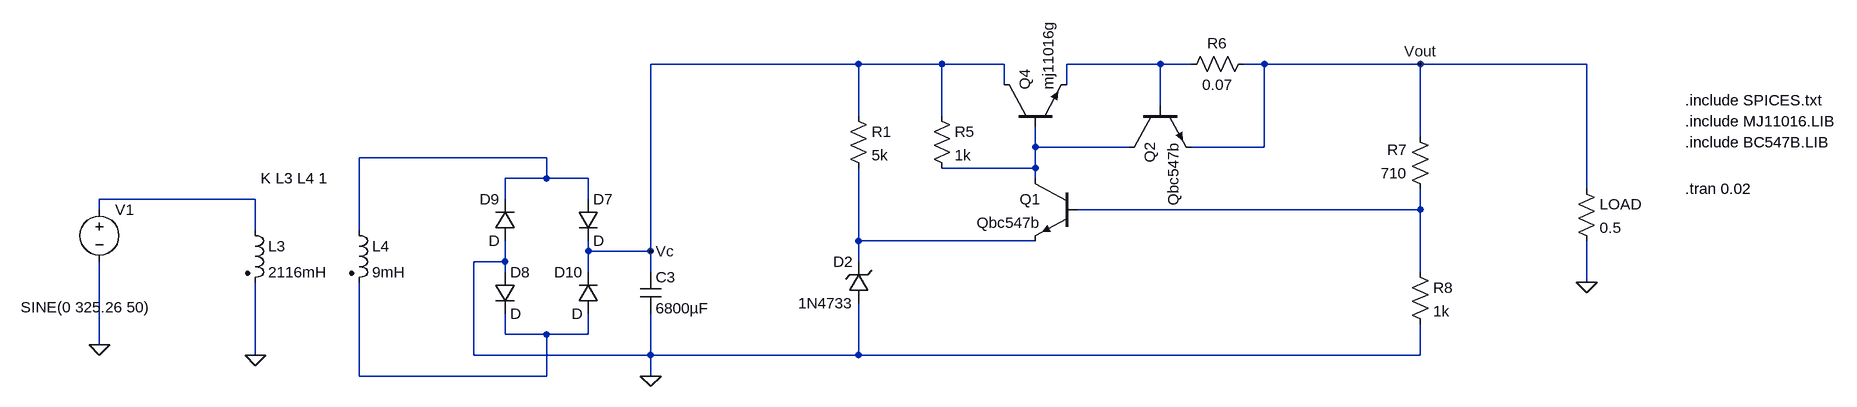
[diagram p0: schematic Basic Sketch 1.asc]
Basic Sketch 1.asc, the LTspice schematic file:
Version 4
SHEET 1 2968 1604
WIRE 1296 720 976 720
WIRE 1424 720 1296 720
WIRE 1520 720 1424 720
WIRE 1760 720 1616 720
WIRE 1808 720 1760 720
WIRE 1920 720 1888 720
WIRE 2160 720 1920 720
WIRE 2416 720 2160 720
WIRE 1520 752 1520 720
WIRE 1616 752 1616 720
WIRE 1760 784 1760 720
WIRE 1296 800 1296 720
WIRE 1424 800 1424 720
WIRE 2160 832 2160 720
WIRE 1568 848 1568 816
WIRE 1712 848 1568 848
WIRE 1920 848 1920 720
WIRE 1920 848 1808 848
WIRE 816 864 528 864
WIRE 1568 880 1568 848
WIRE 1568 880 1424 880
WIRE 816 896 816 864
WIRE 816 896 752 896
WIRE 880 896 816 896
WIRE 1568 896 1568 880
WIRE 2416 912 2416 720
WIRE 368 928 128 928
WIRE 752 928 752 896
WIRE 880 928 880 896
WIRE 128 944 128 928
WIRE 2160 944 2160 912
WIRE 2160 944 1632 944
WIRE 368 976 368 928
WIRE 528 976 528 864
WIRE 1296 992 1296 880
WIRE 1568 992 1296 992
WIRE 880 1008 880 992
WIRE 976 1008 976 720
WIRE 976 1008 880 1008
WIRE 752 1024 752 992
WIRE 752 1024 704 1024
WIRE 1296 1024 1296 992
WIRE 752 1040 752 1024
WIRE 880 1040 880 1008
WIRE 976 1040 976 1008
WIRE 2160 1040 2160 944
WIRE 2416 1056 2416 992
WIRE 752 1136 752 1104
WIRE 816 1136 752 1136
WIRE 880 1136 880 1104
WIRE 880 1136 816 1136
WIRE 128 1152 128 1024
WIRE 368 1168 368 1056
WIRE 704 1168 704 1024
WIRE 976 1168 976 1104
WIRE 976 1168 704 1168
WIRE 1296 1168 1296 1088
WIRE 1296 1168 976 1168
WIRE 2160 1168 2160 1120
WIRE 2160 1168 1296 1168
WIRE 528 1200 528 1056
WIRE 816 1200 816 1136
WIRE 816 1200 528 1200
WIRE 976 1200 976 1168
FLAG 128 1152 0
FLAG 368 1168 0
FLAG 976 1200 0
FLAG 2416 1056 0
FLAG 2160 720 Vout
FLAG 976 1008 Vc
SYMBOL voltage 128 928 R0
WINDOW 123 0 0 Left 0
WINDOW 39 0 0 Left 0
WINDOW 3 -121 166 Left 2
SYMATTR Value SINE(0 325.26 50)
SYMATTR InstName V1
SYMBOL ind2 352 960 R0
SYMATTR InstName L3
SYMATTR SpiceLine Rser=0.001
SYMATTR Value 2116mH
SYMATTR Type ind
SYMBOL ind2 512 960 R0
SYMATTR InstName L4
SYMATTR Value 9mH
SYMATTR Type ind
SYMBOL diode 864 928 R0
SYMATTR InstName D7
SYMBOL diode 736 1040 R0
SYMATTR InstName D8
SYMBOL diode 768 992 R180
WINDOW 0 24 64 Left 2
WINDOW 3 24 0 Left 2
SYMATTR InstName D9
SYMBOL diode 896 1104 R180
WINDOW 0 24 64 Left 2
WINDOW 3 24 0 Left 2
SYMATTR InstName D10
SYMBOL cap 960 1040 R0
SYMATTR InstName C3
SYMATTR Value 6800µF
SYMBOL npn 1520 816 R270
SYMATTR InstName Q4
SYMATTR Value mj11016g
SYMATTR Prefix X
SYMBOL res 1408 784 R0
SYMATTR InstName R5
SYMATTR Value 1k
SYMBOL res 1904 704 R90
WINDOW 0 0 56 VBottom 2
WINDOW 3 32 56 VTop 2
SYMATTR InstName R6
SYMATTR Value 0.07
SYMBOL res 2176 928 R180
WINDOW 0 36 76 Left 2
WINDOW 3 36 40 Left 2
SYMATTR InstName R7
SYMATTR Value 710
SYMBOL res 2144 1024 R0
SYMATTR InstName R8
SYMATTR Value 1k
SYMBOL res 2400 896 R0
SYMATTR InstName LOAD
SYMATTR Value 0.5
SYMBOL res 1280 784 R0
SYMATTR InstName R1
SYMATTR Value 5k
SYMBOL zener 1312 1088 R180
WINDOW 0 24 64 Left 2
WINDOW 3 24 0 Left 2
SYMATTR InstName D2
SYMATTR Value 1N4733
SYMBOL npn 1632 896 M0
SYMATTR InstName Q1
SYMATTR Value Qbc547b
SYMATTR Prefix Q
SYMBOL npn 1712 784 M90
SYMATTR InstName Q2
SYMATTR Value Qbc547b
SYMATTR Prefix Q
TEXT 376 896 Left 2 !K L3 L4 1
TEXT 2568 776 Left 2 !.include SPICES.txt
TEXT 2568 808 Left 2 !.include MJ11016.LIB
TEXT 2568 840 Left 2 !.include BC547B.LIB
TEXT 2568 912 Left 2 !.tran 0.02

The netlist it stands for:
* Basic Sketch 1.asc
V1 N004 0 SINE(0 325.26 50)
L3 N004 0 2116mH Rser=0.001
L4 N003 N007 9mH
D7 N003 Vc D
D8 0 N007 D
D9 0 N003 D
D10 N007 Vc D
C3 Vc 0 6800µF
XQ4 Vc N002 N001 mj11016g  ; pins C B E
R5 Vc N002 1k
R6 Vout N001 0.07
R7 N005 Vout 710
R8 N005 0 1k
R§LOAD Vout 0 0.5
R1 Vc N006 5k
D2 0 N006 1N4733
Q1 N002 N005 N006 0 Qbc547b
Q2 N002 N001 Vout 0 Qbc547b
.model D D
.lib standard.dio
.model NPN NPN
.model PNP PNP
.lib standard.bjt
K L3 L4 1
.include SPICES.txt
.include MJ11016.LIB
.include BC547B.LIB
.tran 0.02
.backanno
.end

* Results of the author's LTspice run, read from the files saved beside the schematic
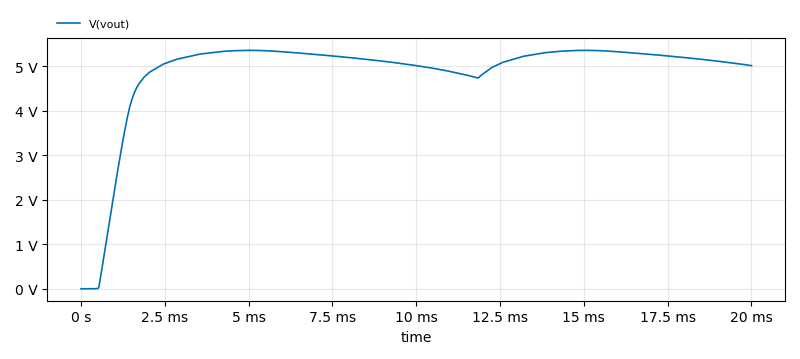
[diagram p1: Transient Analysis of Basic Sketch 1.asc, plotted from the saved traces]
* Transient Analysis, 1 run:
*   V(vout): min 0 V, max 5.358 V, average 4.886 V, rms 5.003 V, last 5.015 V